# EAGLE design LPS_Breakout (EAGLE 9.5.2)
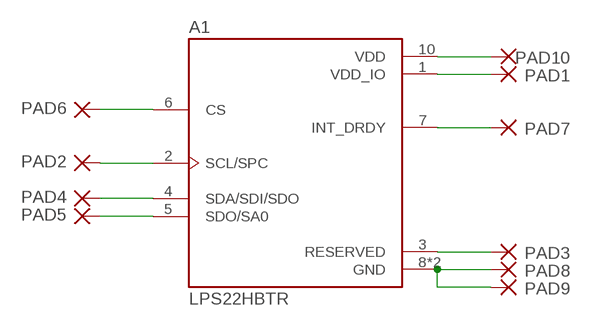
[diagram p0: schematic, sheet 1]

## Parts
A1  LPS22HBTR  [PQFN50P200X200X80-10N]
PAD1  1,6/0,8  [1,6/0,8]
PAD2  1,6/0,8  [1,6/0,8]
PAD3  1,6/0,8  [1,6/0,8]
PAD4  1,6/0,8  [1,6/0,8]
PAD5  1,6/0,8  [1,6/0,8]
PAD6  1,6/0,8  [1,6/0,8]
PAD7  1,6/0,8  [1,6/0,8]
PAD8  1,6/0,8  [1,6/0,8]
PAD9  1,6/0,8  [1,6/0,8]
PAD10  1,6/0,8  [1,6/0,8]

## Nets
N$1: A1.1(VDD_IO) PAD1.1(P)
N$2: A1.2(SCL/SPC) PAD2.1(P)
N$3: A1.3(RESERVED) PAD3.1(P)
N$4: A1.4(SDA/SDI/SDO) PAD4.1(P)
N$5: A1.5(SDO/SA0) PAD5.1(P)
N$6: A1.6(CS) PAD6.1(P)
N$7: A1.7(INT_DRDY) PAD7.1(P)
N$8: A1.8(GND) A1.9(GND) PAD8.1(P) PAD9.1(P)
N$10: A1.10(VDD) PAD10.1(P)

## Library data of the parts
A1 = LPS22HBTR:LPS22HBTR: Pressure Sensor 3.77PSI ~ 18.27PSI (26kPa ~ 126kPa) Absolute 24 b 10-WFLGA Exposed Pad; DESCRIPTION: Pressure Sensor 3.77PSI ~ 18.27PSI (26kPa ~ 126kPa) Absolute 24 b 10-WFLGA Exposed Pad; DIGI-KEY_PART_NUMBER: 497-16265-1-ND; MF: STMicroelectronics; MP: LPS22HBTR; PACKAGE: WFLGA-10 STMicroelectronics; PURCHASE-URL: https://pricing.snapeda.com/search/part/LPS22HBTR/?ref=eda
PAD1-PAD10 = wirepad:1,6/0,8: THROUGH-HOLE PAD

## Board
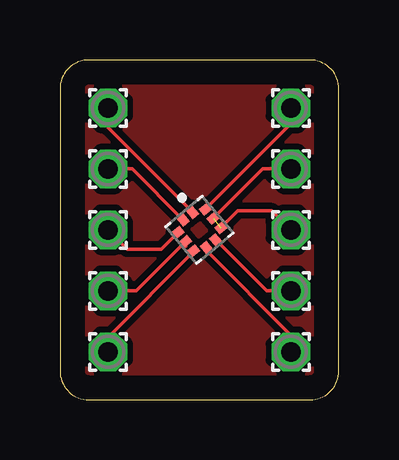
[diagram p1: board, top side]

Size 11.62 x 14.16 mm. Coordinates in mm from the lower left corner, seen from the top.
Outline: 0,12.96 0,1.2 arc90 1.2,0 10.42,0 arc90 11.62,1.2 11.62,12.96 arc90 10.42,14.16 1.2,14.16 arc90 0,12.96
Copper layers (1*16): Top 0.035mm / dielectric 1.5mm / Bottom 0.035mm
Design rules "default": minimum track width 6mil, minimum drill 0.35mm, track to track 6mil, track to pad 6mil, pad to pad 6mil, via to via 6mil, smd to smd 6mil, copper to edge 40mil, drill to drill 6mil, minimum pad ring 10mil, minimum via ring 8mil, stop-mask expansion 4mil, vias tented up to drill 0mil, thermal gap 10mil

### Footprints (pad centres in the part's own frame; a part is rotated, then mirrored left to right if it is on the bottom)
PQFN50P200X200X80-10N = smd 0.43 x 0.35: 1 -0.745,0.25; 2 -0.745,-0.25; 6 0.745,-0.25; 7 0.745,0.25 | smd 0.35 x 0.43: 3 -0.5,-0.745; 4 0,-0.745; 5 0.5,-0.745; 8 0.5,0.745; 9 0,0.745; 10 -0.5,0.745
1,6/0,8 = drill 0.813 pad 1.6 octagon: 1 0,0

### Placement (x,y rotation side)
A1  5.81,7.08 310 top
PAD1  2,12.16 0 top
PAD2  2,9.62 0 top
PAD3  2,7.08 0 top
PAD4  2,4.54 0 top
PAD5  2,2 0 top
PAD6  9.62,2 0 top
PAD7  9.62,4.54 0 top
PAD8  9.62,7.08 0 top
PAD9  9.62,9.62 0 top
PAD10  9.62,12.16 0 top

### Tracks (layer width: path | path; a pad name or v marks a point on that pad's centre or on a via)
GND
  pour Top (isolate 0.254): 0,14.2 0,-0.1 11.5,-0.1 11.7,0.1 11.7,14.1 11.6,14.2
N$1
  Top 0.152: A1.1 2,11.33 PAD1.1
N$2
  Top 0.152: A1.2 3.01,9.62 PAD2.1
N$3
  Top 0.152: A1.3 4.22,6.28 2.8,6.28 PAD3.1
N$4
  Top 0.152: 5.24,6.4 A1.4 3.18,4.54 PAD4.1
N$5
  Top 0.152: A1.5 5.56,6.16 2,2.6 PAD5.1
N$6
  Top 0.152: A1.6 6.1,6.22 9.62,2.7 PAD6.1
N$7
  Top 0.152: A1.7 8.61,4.54 PAD7.1
N$8  (1 unrouted)
  Top 0.152: A1.8 7.4,7.88 8.82,7.88 PAD8.1 | A1.9 8.44,9.62 PAD9.1
N$10
  Top 0.152: A1.10 9.62,11.5 PAD10.1